# EAGLE design PROTOTYPE4 (EAGLE 8.2.2)
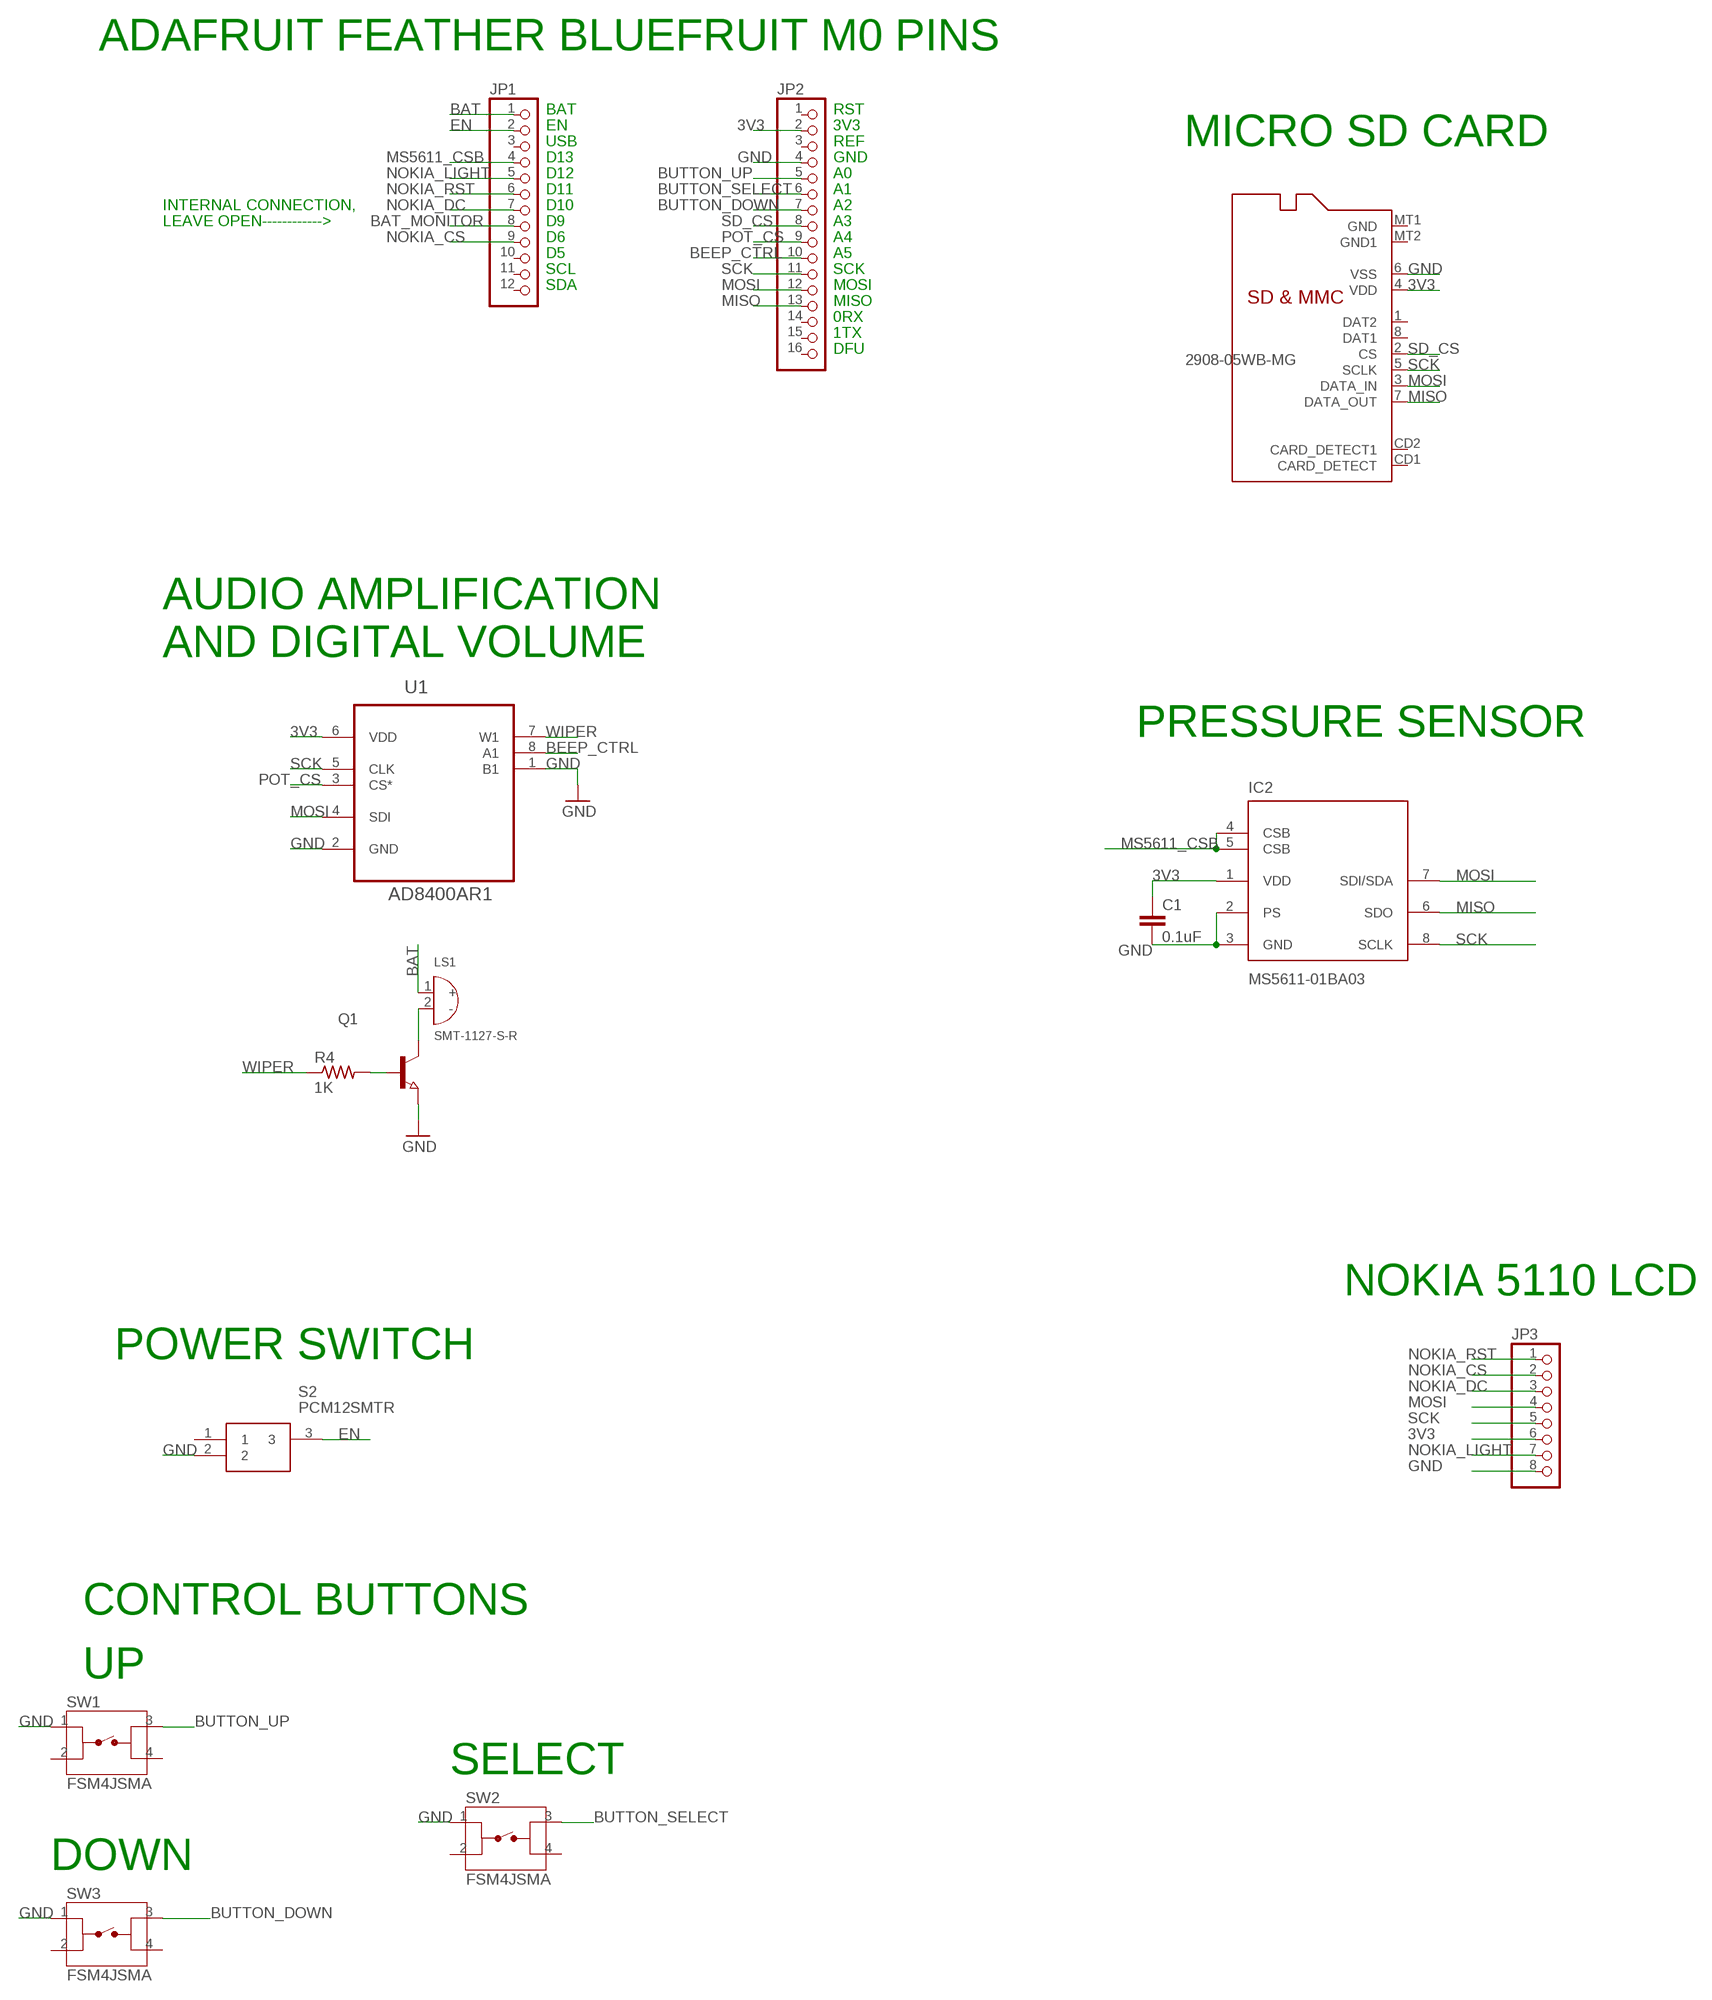
[diagram p0: schematic, sheet 1]

## Parts
C1  0.1uF  C-EUC0805K  [C0805K]
IC2  MS5611-01BA03  MS5611-01BA03UNO  [SON125P300X500X100-8N]
JP1  PINHD-1X12  [1X12]
JP2  PINHD-1X16  [1X16]
JP3  PINHD-1X8  [1X08]
LS1  SMT-1127-S-R  [XDCR_SMT-1127-S-R]
Q1  NPN-TRANSISTOR_SOT23  [SOT23]
R4  1K  R-US_R0805  [R0805]
S2  PCM12SMTR  [PCM12SMTR_1]
SW1  FSM4JSMA  [TE_FSM4JSMA]
SW2  FSM4JSMA  [TE_FSM4JSMA]
SW3  FSM4JSMA  [TE_FSM4JSMA]
U1  AD8400AR1  [SOIC127P600X175-8N]
U$1  2908-05WB-MG  MICROSD  [MICROSD]

## Nets
3V3: C1.1 IC2.1(VDD) JP2.2 JP3.6 U1.6(VDD) U$1.4(VDD)
BAT: JP1.1 LS1.1(+)
BAT_MONITOR: JP1.8
BEEP_CTRL: JP2.10 U1.8(A1)
BUTTON_DOWN: JP2.7 SW3.3
BUTTON_SELECT: JP2.6 SW2.3
BUTTON_UP: JP2.5 SW1.3
EN: JP1.2 S2.3
GND: C1.2 IC2.2(PS) IC2.3(GND) JP2.4 JP3.8 Q1.2(E) S2.2 SW1.1 SW2.1 SW3.1 U1.1(B1) U1.2(GND) U$1.6(VSS)
MISO: IC2.6(SDO) JP2.13 U$1.7(DATA_OUT)
MOSI: IC2.7(SDI/SDA) JP2.12 JP3.4 U1.4(SDI) U$1.3(DATA_IN)
MS5611_CSB: IC2.4(CSB) IC2.5(CSB) JP1.4
N$7: Q1.1(B) R4.2
N$9: LS1.2(-) Q1.3(C)
NOKIA_CS: JP1.9 JP3.2
NOKIA_DC: JP1.7 JP3.3
NOKIA_LIGHT: JP1.5 JP3.7
NOKIA_RST: JP1.6 JP3.1
POT_CS: JP2.9 U1.3(CS*)
SCK: IC2.8(SCLK) JP2.11 JP3.5 U1.5(CLK) U$1.5(SCLK)
SD_CS: JP2.8 U$1.2(CS)
WIPER: R4.1 U1.7(W1)
Unconnected: JP1.3 JP1.10 JP1.11 JP1.12 JP2.1 JP2.3 JP2.14 JP2.15 JP2.16 S2.1 SW1.2 SW1.4 SW2.2 SW2.4 SW3.2 SW3.4 U$1.1(DAT2) U$1.8(DAT1) U$1.CD1(CARD_DETECT) U$1.CD2(CARD_DETECT1) U$1.MT1(GND) U$1.MT2(GND1)

## Notes on the sheet
- ADAFRUIT FEATHER BLUEFRUIT M0 PINS
- BAT | RST
- EN | 3V3
- USB | REF | MICRO SD CARD
- D13 | GND
- D12 | A0
- D11 | A1
- INTERNAL CONNECTION, | D10 | A2
- LEAVE OPEN------------> | D9 | A3
- D6 | A4
- D5 | A5
- SCL | SCK
- SDA | MOSI
- MISO
- 0RX
- 1TX
- DFU
- AUDIO AMPLIFICATION 
  AND DIGITAL VOLUME
- PRESSURE SENSOR
- NOKIA 5110 LCD
- POWER SWITCH
- CONTROL BUTTONS
- UP
- SELECT
- DOWN

## Library data of the parts
C1 = rcl:C-EU: CAPACITOR, European symbol
IC2 = Measurement-Specialties:MS5611-01BA03: Variometer Module, with stainless steel cap
JP1 = pinhead:PINHD-1X12: PIN HEADER
JP2 = pinhead:PINHD-1X16: PIN HEADER
JP3 = pinhead:PINHD-1X8: PIN HEADER
LS1 = SMT-1127-S-R:SMT-1127-S-R: Audio Indicator Transducer Electromagnetic 3.6Vpk 100mA Solder Pad 2.5Vpk 2231Hz to 3231Hz Surface Mount; AVAILABILITY: Good; DESCRIPTION: Black Passive Electromagnetic SMD Buzzer 3V 80mA 2700Hz 92dB 9x3.2mm; MF: PUI Audio; MP: BOT-03D-BUJEON, SMT-1127-S-R; PACKAGE: None; PRICE: 1.43 USD
Q1 = semicon-smd-ipc:NPN-TRANSISTOR_: NPN TRANSISTOR
R4 = resistor:R-US_: RESISTOR, American symbol
S2 = PCM12SMTR:PCM12SMTR: C & K COMPONENTS - PCM12SMTR - SWITCH, SPDT, 0.3A, 6VDC, SMD Source: Datasheet <http://www.farnell.com/datasheets/1789487.pdf>; ALLIED_NUMBER: 70417448; ALLIED_PRICE/STOCK: http://www.alliedelec.com/c-k-components-pcm12smtr/70417448/; DESCRIPTION: C & K COMPONENTS - PCM12SMTR - SWITCH, SPDT, 0.3A, 6VDC, SMD; HEIGHT: mm; MANUFACTURER_NAME: C & K COMPONENTS; MANUFACTURER_PART_NUMBER: PCM12SMTR; RS_PART_NUMBER: 7931721P; RS_PRICE/STOCK: http://uk.rs-online.com/web/p/products/7931721P
SW1-SW3 = FSM4JSMA:FSM4JSMA: Switch Tactile OFF (ON) SPST Round Button Gull Wing 0.05A 24VDC 2.6N SMD T/R; AVAILABILITY: Unavailable; DESCRIPTION: Print key [TE Connectivity] FSM-4J-SMA Print key; MF: TE Connectivity; MP: FSM-4J-SMA; PACKAGE: None; PRICE: None
U1 = AD8400AR1:AD8400AR1: Digital Potentiometers; AVAILABILITY: Good; DESCRIPTION: Digital Potentiometer 256POS 1kOhm Single 8-Pin SOIC N Tube; MF: Analog Devices; MP: AD8400ARZ1; PACKAGE: SOIC-8 Analog Devices; PRICE: 2.43 USD
U$1 = adafruit:MICROSD: Micro-SD / Transflash card holder with SPI pinout For the 3M # 2908-05WB-MG and/or 4UCON #19656 push-push type; ACTUAL_PART_NUMBER: 2908-05WB-MG; KEEP_IN_MIND_ALTERNATE_PACKAGE: 5031821852

## Board
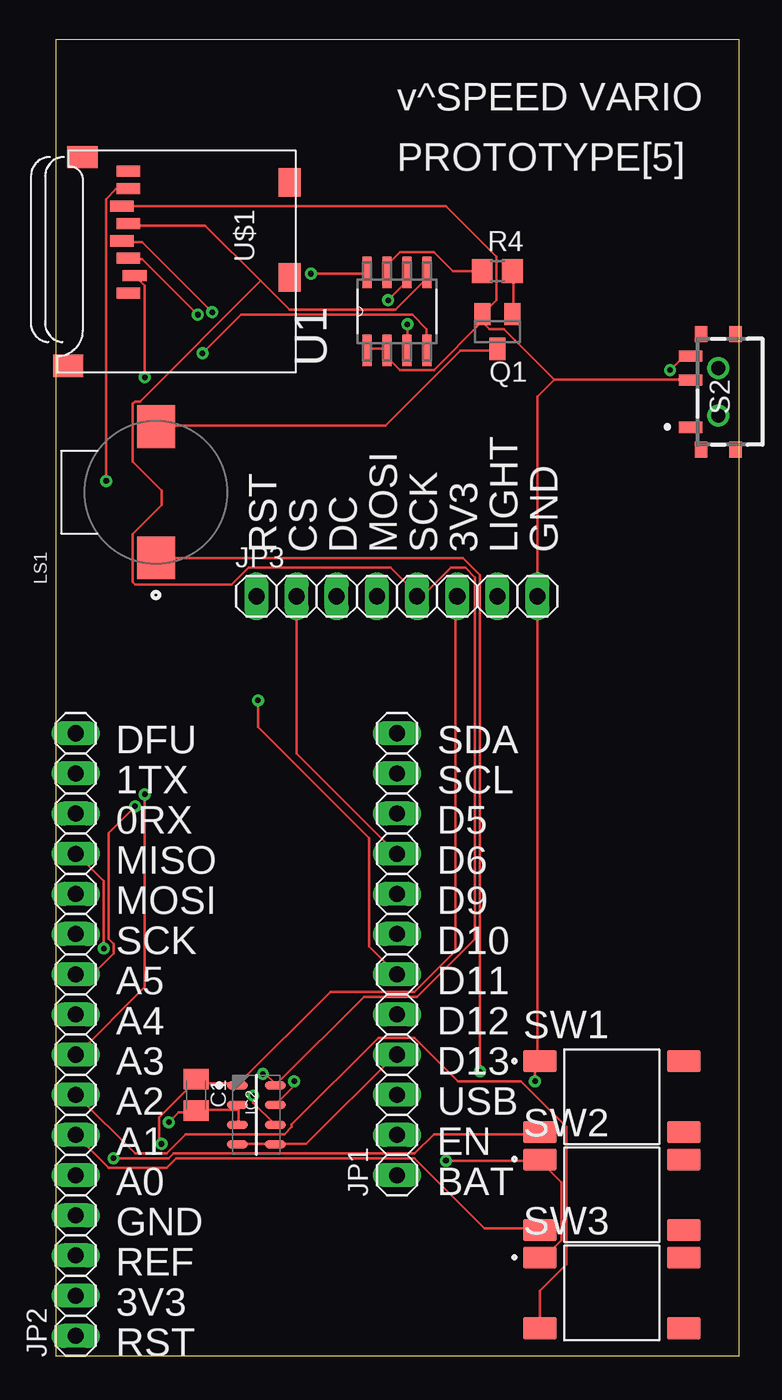
[diagram p1: board, top side]
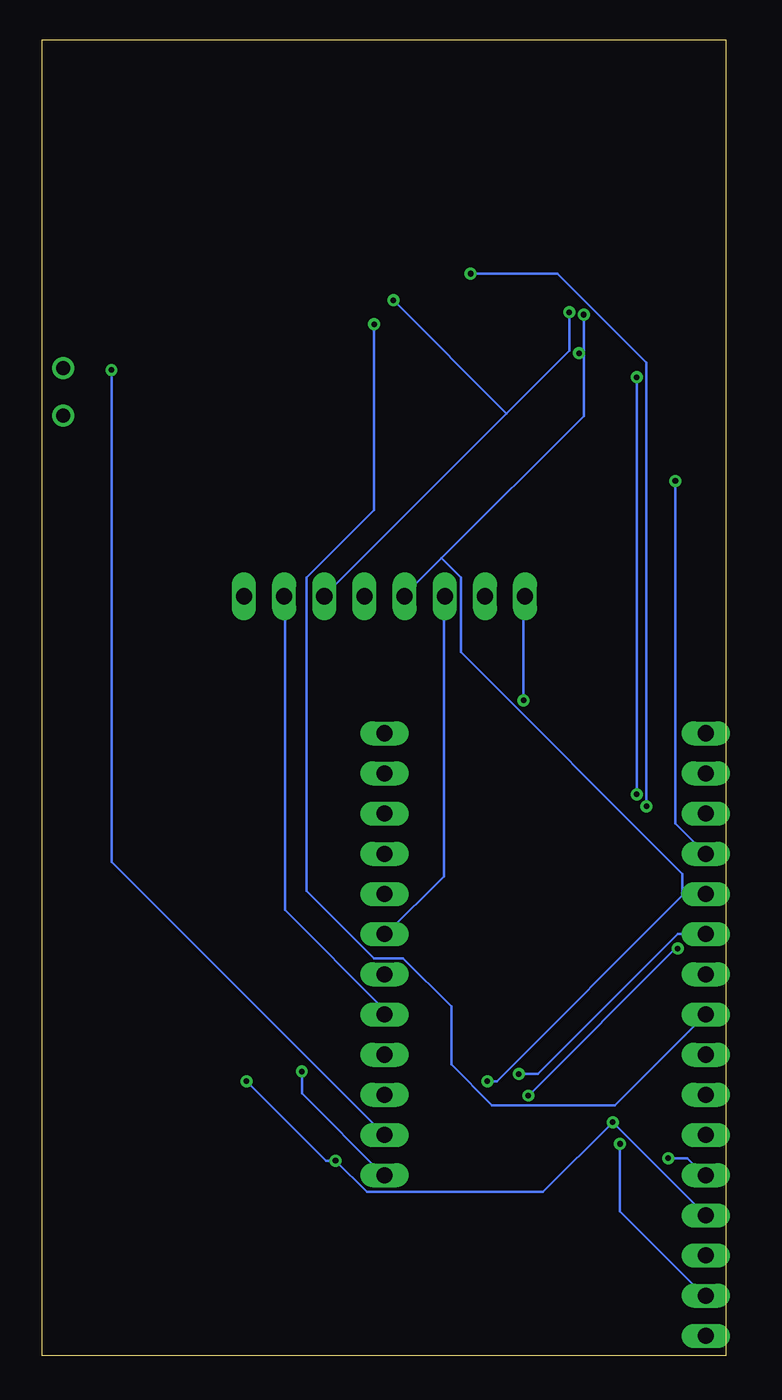
[diagram p2: board, bottom side, seen from below]

Size 43.25 x 83.23 mm. Coordinates in mm from the lower left corner, seen from the top.
Outline: 0,0 43.25,0 43.25,83.23 0,83.23 0,0
Copper layers (1*16): Top 0.035mm / dielectric 1.5mm / Bottom 0.035mm
Design rules "default": minimum track width 6mil, minimum drill 0.35mm, track to track 6mil, track to pad 6mil, pad to pad 6mil, via to via 6mil, smd to smd 6mil, copper to edge 40mil, drill to drill 6mil, minimum pad ring 10mil, minimum via ring 8mil, stop-mask expansion 4mil, vias tented up to drill 0mil, thermal gap 10mil

### Footprints (pad centres in the part's own frame; a part is rotated, then mirrored left to right if it is on the bottom)
C0805K = smd 1.3 x 1.6: 1 -1,0; 2 1,0
SON125P300X500X100-8N = smd 1.35 x 0.55: 1 -1.2,1.875; 2 -1.2,0.625; 3 -1.2,-0.625; 4 -1.2,-1.875; 5 1.2,-1.875; 6 1.2,-0.625; 7 1.2,0.625; 8 1.2,1.875
1X12 = drill 1.016 long: 1 -13.97,0; 2 -11.43,0; 3 -8.89,0; 4 -6.35,0; 5 -3.81,0; 6 -1.27,0; 7 1.27,0; 8 3.81,0; 9 6.35,0; 10 8.89,0; 11 11.43,0; 12 13.97,0
1X16 = drill 1.016 long: 1 -19.05,0; 2 -16.51,0; 3 -13.97,0; 4 -11.43,0; 5 -8.89,0; 6 -6.35,0; 7 -3.81,0; 8 -1.27,0; 9 1.27,0; 10 3.81,0; 11 6.35,0; 12 8.89,0; 13 11.43,0; 14 13.97,0; 15 16.51,0; 16 19.05,0
1X08 = drill 1.016 long: 1 -8.89,0; 2 -6.35,0; 3 -3.81,0; 4 -1.27,0; 5 1.27,0; 6 3.81,0; 7 6.35,0; 8 8.89,0
XDCR_SMT-1127-S-R = smd 2.71 x 2.41: 1 -4.15,0; 2 4.15,0
SOT23 = smd 1 x 1.4: 1 -0.95,-1.1; 2 0.95,-1.1; 3 0,1.1
R0805 = smd 1.3 x 1.5: 1 -0.95,0; 2 0.95,0
PCM12SMTR_1 = smd 0.7 x 1.5: 1 -2.25,1.75; 2 0.75,1.75; 3 2.25,1.75 | smd 1 x 0.8: 4 -3.65,1.1; 5 -3.65,-1.1; 6 3.65,1.1; 7 3.65,-1.1 | drill 0.9 pad 1.4: 8 -1.5,0; 9 1.5,0
TE_FSM4JSMA = smd 2.1 x 1.38: 1 -4.55,2.24; 2 4.55,2.24; 3 -4.55,-2.24; 4 4.55,-2.24
SOIC127P600X175-8N = smd 1.981 x 0.559: 1 -2.464,1.905; 2 -2.464,0.635; 3 -2.464,-0.635; 4 -2.464,-1.905; 5 2.464,-1.905; 6 2.464,-0.635; 7 2.464,0.635; 8 2.464,1.905
MICROSD = smd 0.7 x 1.5: 1 9,-10.64; 2 7.9,-10.24; 3 6.8,-10.64; 4 5.7,-11.04; 5 4.6,-10.64; 6 3.5,-11.04; 7 2.4,-10.64; 8 1.3,-10.64 | smd 1.8 x 1.4: CD1 2,-0.44; CD2 8,-0.44 | smd 1.4 x 1.9: MT1 0.4,-13.54; MT2 13.6,-14.44

### Placement (x,y rotation side)
C1  8.89,16.51 270 top
IC2  12.7,15.24 0 top
JP1  21.59,25.4 90 top
JP2  1.27,20.32 90 top
JP3  21.59,48.03 0 top
LS1  6.35,54.61 90 top
Q1  27.94,64.77 180 top
R4  27.94,68.58 0 top
S2  41.91,60.96 90 top
SW1  35.17,16.39 0 top
SW2  35.17,10.19 0 top
SW3  35.17,3.99 0 top
U1  21.59,66.04 90 top
U$1  15.24,76.2 270 top

### Tracks (layer width: path | path; a pad name or v marks a point on that pad's centre or on a via)
3V3  (via drill 0.35)
  Top 0.152: v6.71,13.41 6.55,13.56 6.55,15.09 8.84,17.37 C1.1 8.99,17.37 9.14,17.22 11.43,17.22 IC2.1 11.58,17.22 17.37,23.01 22.71,23.01 25.3,25.6 25.3,48.01 JP3.6 | v9.91,65.99 5.49,70.41 4.27,70.41 U$1.4 | v21.03,66.75 22.1,67.82 22.1,68.43 U1.6
  Bottom 0.152: v6.71,13.41 6.71,9.14 1.37,3.81 JP2.2 | v9.91,65.99 9.91,63.55 13.87,59.59 | 13.87,59.59 25.3,48.16 JP3.6 | 13.87,59.59 v21.03,66.75
BAT  (via drill 0.35)
  Top 0.152: v26.82,17.98 26.82,49.38 25.76,50.44 6.4,50.44 LS1.1
  Bottom 0.152: v26.82,17.98 26.82,16.61 21.64,11.43 JP1.1
BEEP_CTRL  (via drill 0.35)
  Top 0.152: v16.15,68.43 19.66,68.43 U1.8 | v5.03,34.75 3.35,33.07 3.35,26.36 3.66,26.06 3.66,25.45 2.44,24.23 1.37,24.23 JP2.10
  Bottom 0.152: v16.15,68.43 10.67,68.43 5.03,62.79 v5.03,34.75
BUTTON_DOWN
  Top 0.152: SW3.3 30.63,1.83 30.63,4.12 32.31,5.79 32.31,14.48 29.41,17.37 25.45,17.37 22.71,20.12 20.42,20.12 14.94,14.63 14.94,14.48 14.48,14.02 8.23,14.02 7.01,12.8 5.03,12.8 1.37,16.46 JP2.7
BUTTON_SELECT
  Top 0.152: JP2.6 3.35,11.89 7.01,11.89 7.62,12.5 22.71,12.5 27.13,8.08 30.48,8.08 SW2.3
BUTTON_UP  (via drill 0.35)
  Top 0.152: v3.66,12.5 7.16,12.5 7.47,12.8 22.71,12.8 23.93,14.02 30.48,14.02 SW1.3
  Bottom 0.152: v3.66,12.5 2.44,12.5 1.37,11.43 JP2.5
EN  (via drill 0.35)
  Top 0.152: v38.86,62.33 39.62,63.09 40.08,63.09 S2.3
  Bottom 0.152: v38.86,62.33 38.86,31.24 JP1.2
GND  (via drill 0.35)
  Top 0.152: SW3.1 30.63,6.25 30.94,6.25 32,7.32 32,10.97 30.63,12.34 SW2.1 30.48,12.34 v24.69,12.34 | 11.58,15.54 11.58,15.85 IC2.2 | 11.58,15.54 11.58,14.63 IC2.3 | 11.58,15.54 8.99,15.54 C1.2 8.84,15.39 7.77,15.39 v7.16,14.78 | 26.98,65.38 26.98,65.84 Q1.2 | 26.98,65.38 23.93,62.33 21.79,62.33 21.03,63.09 21.03,63.55 U1.2 20.88,63.7 19.81,63.7 U1.1 | U$1.6 4.27,72.69 24.69,72.69 27.89,69.49 27.89,66.75 27.13,65.99 Q1.2 | 31.55,61.72 40.08,61.72 S2.2 | 31.55,61.72 28.35,64.92 27.43,64.92 26.98,65.38 | 26.98,65.38 Q1.2 | 31.55,61.72 30.48,60.66 JP3.8 30.48,18.75 SW1.1 30.48,18.59 30.33,18.44 v30.33,17.37
  Bottom 0.152: JP2.4 v7.16,14.78 11.58,10.36 22.71,10.36 v24.69,12.34 25.3,12.34 v30.33,17.37
MISO  (via drill 0.35)
  Top 0.152: v12.5,16.46 12.5,16 13.87,14.63 IC2.6 | v3.05,25.76 3.05,30.02 1.37,31.7 JP2.13 | v3.2,55.32 3.2,73.15 3.81,73.76 4.57,73.76 U$1.7
  Bottom 0.152: v12.5,16.46 3.2,25.76 v3.05,25.76 | v3.2,55.32 3.2,33.68 JP2.13
MOSI  (via drill 0.35)
  Top 0.152: v15.09,17.37 15.09,17.07 14.02,16 IC2.7 | v8.99,65.84 5.49,69.34 4.72,69.34 U$1.3 | v9.3,63.4 11.73,65.84 22.55,65.84 23.47,64.92 23.47,63.7 U1.4
  Bottom 0.152: v15.09,17.37 14.48,17.37 2.74,29.11 | 2.74,29.11 1.37,29.11 JP2.12 2.74,29.11 | 8.99,63.4 8.99,59.44 17.98,50.44 | 8.99,63.4 v8.99,65.84 | 17.98,50.44 20.27,48.16 JP3.4 | 8.99,63.4 v9.3,63.4 | 2.74,29.11 2.74,30.48 16.76,44.5 16.76,49.23 17.98,50.44
MS5611_CSB
  Top 0.152: IC2.4 11.58,13.41 13.87,13.41 IC2.5 14.02,13.41 15.85,13.41 21.49,19.05 JP1.4
N$7
  Top 0.152: Q1.1 28.96,65.99 28.96,68.58 R4.2
N$9
  Top 0.152: Q1.3 27.89,63.55 25.6,63.55 20.88,58.83 6.4,58.83 LS1.2
NOKIA_CS
  Top 0.152: JP3.2 15.24,38.1 JP1.9
NOKIA_DC
  Bottom 0.152: JP3.3 17.83,48.01 17.83,30.33 21.49,26.67 JP1.7
NOKIA_LIGHT
  Bottom 0.152: JP1.5 21.64,21.64 21.64,21.95 27.89,28.19 27.89,48.01 JP3.7
NOKIA_RST  (via drill 0.35)
  Top 0.152: v12.8,41.45 12.8,39.78 19.81,32.77 19.81,25.91 JP1.6
  Bottom 0.152: v12.8,41.45 12.8,48.01 JP3.1
POT_CS  (via drill 0.35)
  Top 0.152: v22.25,65.23 22.25,63.7 U1.3
  Bottom 0.152: v22.25,65.23 22.25,53.49 26.52,49.23 26.52,29.41 22.25,25.15 20.42,25.15 17.37,22.1 17.37,18.44 14.78,15.85 7.01,15.85 JP2.9
SCK  (via drill 0.35)
  Top 0.152: 12.95,67.97 14.78,66.14 21.49,66.14 23.47,68.12 23.47,68.43 U1.5 | 12.95,67.97 9.45,71.48 4.72,71.48 U$1.5 | v13.11,17.83 13.26,17.83 13.87,17.22 IC2.8 14.02,17.22 19.51,22.71 22.86,22.71 26.52,26.36 26.52,49.23 25.91,49.84 24.99,49.84 23.32,48.16 22.86,48.16 | 12.95,67.97 5.33,60.35 5.03,60.35 4.88,60.2 4.88,56.54 6.71,54.71 6.71,53.8 4.88,51.97 4.88,48.92 5.03,48.77 11.12,48.77 12.19,49.84 21.18,49.84 22.86,48.16 | 22.86,48.16 JP3.5
  Bottom 0.152: v13.11,17.83 11.89,17.83 3.05,26.67 JP2.11
SD_CS  (via drill 0.35)
  Top 0.152: v5.64,61.87 5.64,67.67 5.03,68.28 U$1.2 | v5.64,35.51 5.64,23.32 1.37,19.05 JP2.8
  Bottom 0.152: v5.64,35.51 v5.64,61.87
WIPER
  Top 0.152: R4.1 25.15,68.58 23.93,69.8 21.79,69.8 21.03,69.04 21.03,68.58 U1.7

### Text on the board
tPlace: v^SPEED VARIO | PROTOTYPE[5] | RST | CS | DC | MOSI | SCK | 3V3 | LIGHT | GND | DFU | SDA | 1TX | SCL | 0RX | D5 | MISO | D6 | MOSI | D9 | SCK | D10 | A5 | D11 | A4 | D12 | A3 | D13 | A2 | USB | A1 | EN | A0 | BAT | GND | REF | 3V3 | RST